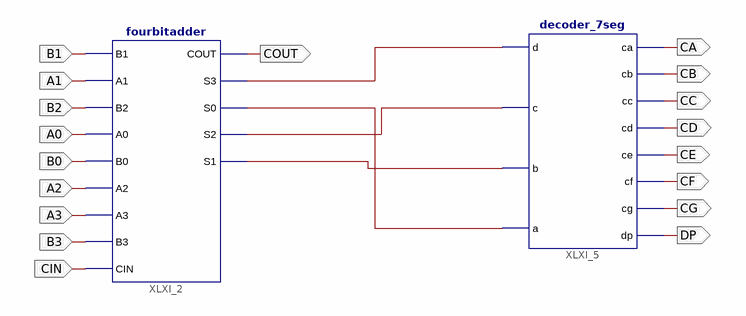
[diagram p0: schematic sheet 1]
// Xilinx ISE schematic adderwithdisplay.sch (spartan3e) as structural Verilog: 2 symbols, 18 ports
module adderwithdisplay (
  input  B1,
  input  A1,
  input  B2,
  input  A0,
  input  B0,
  input  A2,
  input  A3,
  input  B3,
  input  CIN,
  output COUT,
  output CA,
  output CB,
  output CC,
  output CD,
  output CE,
  output CF,
  output CG,
  output DP
);

  wire XLXN_27, XLXN_28, XLXN_29, XLXN_30;

  fourbitadder XLXI_2 (
    .B1(B1), .A1(A1), .B2(B2), .A0(A0), .B0(B0), .A2(A2), .A3(A3), .B3(B3), .CIN(CIN), .COUT(COUT),
    .S3(XLXN_27), .S0(XLXN_28), .S2(XLXN_29), .S1(XLXN_30));
  decoder_7seg XLXI_5 (
    .d(XLXN_27), .c(XLXN_29), .b(XLXN_30), .a(XLXN_28), .ca(CA), .cb(CB), .cc(CC), .cd(CD), .ce(CE), .cf(CF),
    .cg(CG), .dp(DP));
endmodule
